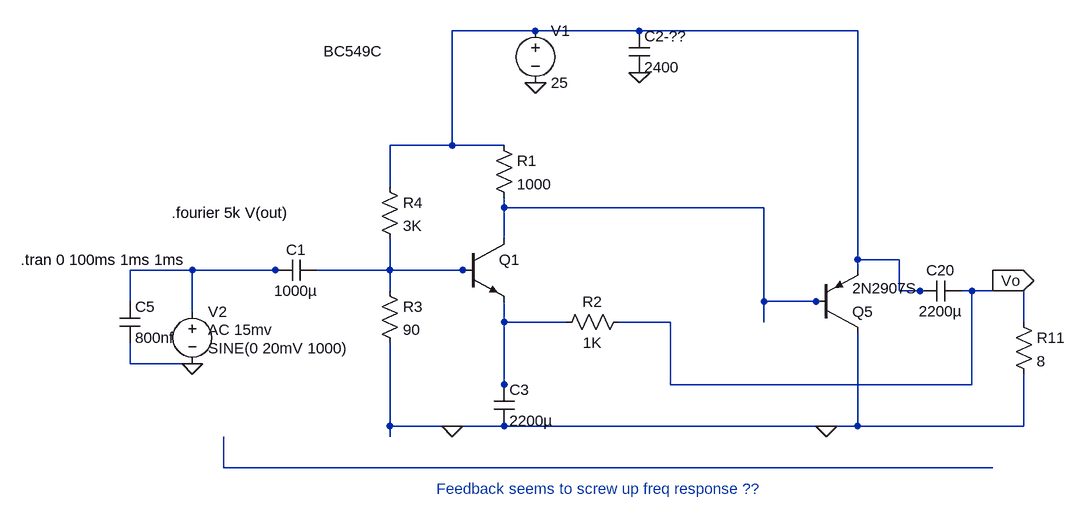
[diagram p0: schematic Single transitor from westhost site with feed back.asc]
Single transitor from westhost site with feed back.asc, the LTspice schematic file:
Version 4
SHEET 1 1788 680
WIRE 272 -256 144 -256
WIRE 432 -256 272 -256
WIRE 768 -256 432 -256
WIRE 144 -80 144 -256
WIRE 144 -80 48 -80
WIRE 224 -80 144 -80
WIRE 48 -16 48 -80
WIRE 224 16 224 0
WIRE 624 16 224 16
WIRE 224 64 224 16
WIRE 768 96 768 -256
WIRE 832 96 768 96
WIRE -256 112 -352 112
WIRE -128 112 -256 112
WIRE -112 112 -128 112
WIRE 48 112 48 64
WIRE 48 112 -64 112
WIRE 160 112 48 112
WIRE 176 112 160 112
WIRE 768 112 768 96
WIRE 48 144 48 112
WIRE 832 144 832 96
WIRE 864 144 832 144
WIRE 880 144 864 144
WIRE 944 144 928 144
WIRE 1024 144 944 144
WIRE -352 160 -352 112
WIRE 624 160 624 16
WIRE 704 160 624 160
WIRE 720 160 704 160
WIRE -256 176 -256 112
WIRE 224 192 224 160
WIRE 320 192 224 192
WIRE 480 192 400 192
WIRE 624 192 624 160
WIRE 1024 192 1024 144
WIRE -352 256 -352 224
WIRE -272 256 -352 256
WIRE 224 288 224 192
WIRE 480 288 480 192
WIRE 944 288 944 144
WIRE 944 288 480 288
WIRE 224 304 224 288
WIRE 48 352 48 224
WIRE 144 352 48 352
WIRE 224 352 144 352
WIRE 720 352 224 352
WIRE 768 352 768 208
WIRE 768 352 720 352
WIRE 1024 352 1024 272
WIRE 1024 352 768 352
WIRE 48 368 48 352
WIRE -208 416 -208 368
WIRE 976 416 -208 416
FLAG 272 -176 0
FLAG 144 352 0
FLAG -256 256 0
FLAG 720 352 0
FLAG 432 -192 0
FLAG 976 128 Vo
IOPIN 976 128 Out
SYMBOL npn 160 64 R0
WINDOW 3 -214 -289 Left 2
SYMATTR Value BC549C
SYMATTR InstName Q1
SYMBOL res 208 -96 R0
SYMATTR InstName R1
SYMATTR Value 1000
SYMBOL voltage 272 -272 R0
WINDOW 123 0 0 Left 2
WINDOW 39 0 0 Left 2
SYMATTR InstName V1
SYMATTR Value 25
SYMBOL res 32 -32 R0
SYMATTR InstName R4
SYMATTR Value 3K
SYMBOL res 32 128 R0
SYMATTR InstName R3
SYMATTR Value 90
SYMBOL cap -64 96 R90
WINDOW 0 0 32 VBottom 2
WINDOW 3 32 32 VTop 2
SYMATTR InstName C1
SYMATTR Value 1000µ
SYMBOL voltage -256 160 R0
WINDOW 123 24 44 Left 2
WINDOW 39 0 0 Left 2
WINDOW 3 24 72 Left 2
SYMATTR Value2 AC 15mv
SYMATTR Value SINE(0 20mV 1000)
SYMATTR InstName V2
SYMBOL cap -368 160 R0
SYMATTR InstName C5
SYMATTR Value 800nf
SYMBOL res 1008 176 R0
SYMATTR InstName R11
SYMATTR Value 8
SYMBOL pnp 704 208 M180
SYMATTR InstName Q5
SYMATTR Value 2N2907S
SYMBOL cap 928 128 R90
WINDOW 0 0 32 VBottom 2
WINDOW 3 32 32 VTop 2
SYMATTR InstName C20
SYMATTR Value 2200µ
SYMBOL cap 416 -256 R0
SYMATTR InstName C2-??
SYMATTR Value 2400
SYMBOL cap 208 288 R0
SYMATTR InstName C3
SYMATTR Value 2200µ
SYMBOL res 416 176 R90
WINDOW 0 0 56 VBottom 2
WINDOW 3 32 56 VTop 2
SYMATTR InstName R2
SYMATTR Value 1K
TEXT -520 96 Left 2 !.tran 0 100ms 1ms 1ms
TEXT 120 448 Left 2 ;Feedback seems to screw up freq response ??
TEXT -288 24 Left 2 !.fourier 5k V(out)

The netlist it stands for:
* Single transitor from westhost site with feed back.asc
Q1 N002 N004 N006 0 BC549C
R1 N001 N002 1000
V1 N001 0 25
R4 N001 N004 3K
R3 N004 0 90
C1 N004 N003 1000µ
V2 N003 0 SINE(0 20mV 1000) AC 15mv
C5 N003 N007 800nf
R11 N005 0 8
Q5 0 N002 N001 0 2N2907S
C20 N005 N001 2200µ
C2-?? N001 0 2400
C3 N006 0 2200µ
R2 N005 N006 1K
.model NPN NPN
.model PNP PNP
.lib standard.bjt
.tran 0 100ms 1ms 1ms
* Feedback seems to screw up freq response ??
.fourier 5k V(out)
.backanno
.end